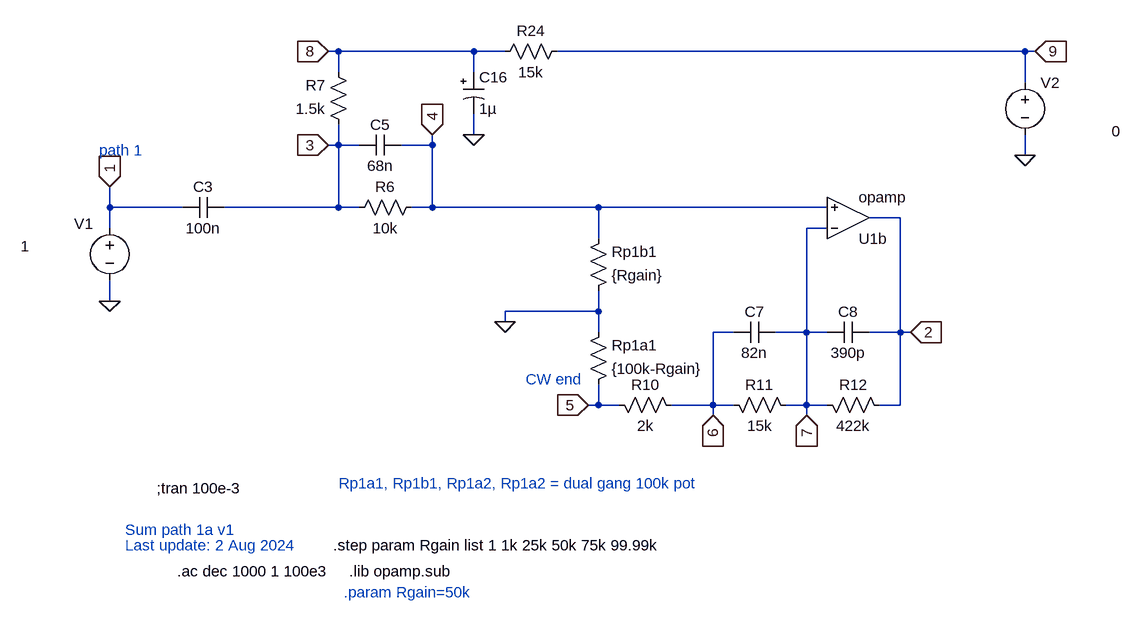
[diagram p0: schematic Klon-Centaur_sum_path1a_v1.asc]
Klon-Centaur_sum_path1a_v1.asc, the LTspice schematic file:
Version 4
SHEET 1 4496 5064
WIRE -32 2320 -48 2320
WIRE 176 2320 -32 2320
WIRE 224 2320 176 2320
WIRE 1024 2320 304 2320
WIRE 1040 2320 1024 2320
WIRE -32 2352 -32 2320
WIRE 176 2352 176 2320
WIRE 1024 2368 1024 2320
WIRE 176 2448 176 2416
WIRE -32 2464 -32 2432
WIRE -32 2464 -48 2464
WIRE 0 2464 -32 2464
WIRE 112 2464 112 2448
WIRE 112 2464 64 2464
WIRE 1024 2480 1024 2448
WIRE -384 2560 -384 2528
WIRE -272 2560 -384 2560
WIRE -32 2560 -32 2464
WIRE -32 2560 -208 2560
WIRE 0 2560 -32 2560
WIRE 112 2560 112 2464
WIRE 112 2560 80 2560
WIRE 368 2560 112 2560
WIRE 720 2560 368 2560
WIRE 832 2576 784 2576
WIRE -384 2592 -384 2560
WIRE 720 2592 688 2592
WIRE 368 2608 368 2560
WIRE -384 2704 -384 2672
WIRE 368 2720 368 2688
WIRE 368 2720 224 2720
WIRE 224 2736 224 2720
WIRE 368 2752 368 2720
WIRE 576 2752 544 2752
WIRE 688 2752 688 2592
WIRE 688 2752 640 2752
WIRE 720 2752 688 2752
WIRE 832 2752 832 2576
WIRE 832 2752 784 2752
WIRE 848 2752 832 2752
WIRE 368 2864 368 2832
WIRE 368 2864 352 2864
WIRE 400 2864 368 2864
WIRE 544 2864 544 2752
WIRE 544 2864 480 2864
WIRE 576 2864 544 2864
WIRE 688 2864 688 2752
WIRE 688 2864 656 2864
WIRE 720 2864 688 2864
WIRE 832 2864 832 2752
WIRE 832 2864 800 2864
WIRE 544 2880 544 2864
WIRE 688 2880 688 2864
FLAG -384 2528 1
IOPIN -384 2528 In
FLAG 176 2448 0
FLAG 1040 2320 9
IOPIN 1040 2320 In
FLAG -384 2704 0
FLAG -48 2464 3
IOPIN -48 2464 In
FLAG -48 2320 8
IOPIN -48 2320 In
FLAG 112 2448 4
IOPIN 112 2448 In
FLAG 352 2864 5
IOPIN 352 2864 In
FLAG 544 2880 6
IOPIN 544 2880 In
FLAG 688 2880 7
IOPIN 688 2880 In
FLAG 848 2752 2
IOPIN 848 2752 In
FLAG 224 2736 0
FLAG 1024 2480 0
SYMBOL voltage -384 2576 R0
WINDOW 0 -55 9 Left 2
WINDOW 39 0 0 Left 0
WINDOW 3 -137 44 Left 2
SYMATTR InstName V1
SYMATTR Value 1
SYMATTR Value2 AC 1 0
SYMBOL cap -208 2544 R90
WINDOW 0 0 32 VBottom 2
WINDOW 3 32 32 VTop 2
SYMATTR InstName C3
SYMATTR Value 100n
SYMBOL res 96 2544 R90
WINDOW 0 0 56 VBottom 2
WINDOW 3 32 56 VTop 2
SYMATTR InstName R6
SYMATTR Value 10k
SYMBOL cap 64 2448 R90
WINDOW 0 0 32 VBottom 2
WINDOW 3 32 32 VTop 2
SYMATTR InstName C5
SYMATTR Value 68n
SYMBOL res 352 2704 M180
WINDOW 0 36 76 Left 2
WINDOW 3 36 40 Left 2
SYMATTR InstName Rp1b1
SYMATTR Value {Rgain}
SYMBOL res 352 2848 M180
WINDOW 3 36 40 Left 2
WINDOW 0 36 76 Left 2
SYMATTR Value {100k-Rgain}
SYMATTR InstName Rp1a1
SYMBOL res 496 2880 M270
WINDOW 0 32 56 VTop 2
WINDOW 3 0 56 VBottom 2
SYMATTR InstName R10
SYMATTR Value 2k
SYMBOL res 672 2880 M270
WINDOW 0 32 56 VTop 2
WINDOW 3 0 56 VBottom 2
SYMATTR InstName R11
SYMATTR Value 15k
SYMBOL cap 640 2768 M270
WINDOW 0 32 32 VTop 2
WINDOW 3 0 32 VBottom 2
SYMATTR InstName C7
SYMATTR Value 82n
SYMBOL cap 784 2768 M270
WINDOW 0 32 32 VTop 2
WINDOW 3 0 32 VBottom 2
SYMATTR InstName C8
SYMATTR Value 390p
SYMBOL res 816 2880 M270
WINDOW 0 32 56 VTop 2
WINDOW 3 0 56 VBottom 2
SYMATTR InstName R12
SYMATTR Value 422k
SYMBOL res -16 2448 R180
WINDOW 0 36 76 Left 2
WINDOW 3 36 40 Left 2
SYMATTR InstName R7
SYMATTR Value 1.5k
SYMBOL res 320 2304 R90
WINDOW 0 0 56 VBottom 2
WINDOW 3 32 56 VTop 2
SYMATTR InstName R24
SYMATTR Value 15k
SYMBOL OpAmps\\opamp 752 2640 M180
SYMATTR InstName U1b
SYMBOL polcap 160 2352 R0
SYMATTR InstName C16
SYMATTR Value 1µ
SYMBOL voltage 1024 2352 R0
WINDOW 123 0 0 Left 0
WINDOW 39 0 0 Left 0
WINDOW 3 133 91 Left 2
SYMATTR InstName V2
SYMATTR Value 0
TEXT -16 3120 Left 2 !.lib opamp.sub
TEXT -280 3120 Left 2 !.ac dec 1000 1 100e3
TEXT 256 2824 Left 2 ;CW end
TEXT -40 3080 Left 2 !.step param Rgain list 1 1k 25k 50k 75k 99.99k
TEXT -32 2984 Left 2 ;Rp1a1, Rp1b1, Rp1a2, Rp1a2 = dual gang 100k pot
TEXT -312 2992 Left 2 !;tran 100e-3
TEXT -24 3152 Left 2 ;.param Rgain=50k
TEXT -360 3056 Left 2 ;Sum path 1a v1
TEXT -400 2472 Left 2 ;path 1
TEXT -360 3080 Left 2 ;Last update: 2 Aug 2024

The netlist it stands for:
* Klon-Centaur_sum_path1a_v1.asc
V1 1 0 1 AC 1 0
C3 3 1 100n
R6 4 3 10k
C5 4 3 68n
Rp1b1 0 4 {Rgain}
Rp1a1 5 0 {100k-Rgain}
R10 6 5 2k
R11 7 6 15k
C7 7 6 82n
C8 2 7 390p
R12 2 7 422k
R7 3 8 1.5k
R24 9 8 15k
XU1b 7 4 2 opamp Aol=100K GBW=10Meg  ; pins invin noninvin out
C16 8 0 1µ
V2 9 0 0
.lib opamp.sub
.ac dec 1000 1 100e3
* CW end
.step param Rgain list 1 1k 25k 50k 75k 99.99k
* Rp1a1, Rp1b1, Rp1a2, Rp1a2 = dual gang 100k pot
;tran 100e-3
* .param Rgain=50k
* Sum path 1a v1
* path 1
* Last update: 2 Aug 2024
.backanno
.end